# EAGLE design HeaterMeterLCD (EAGLE 6.6.0)
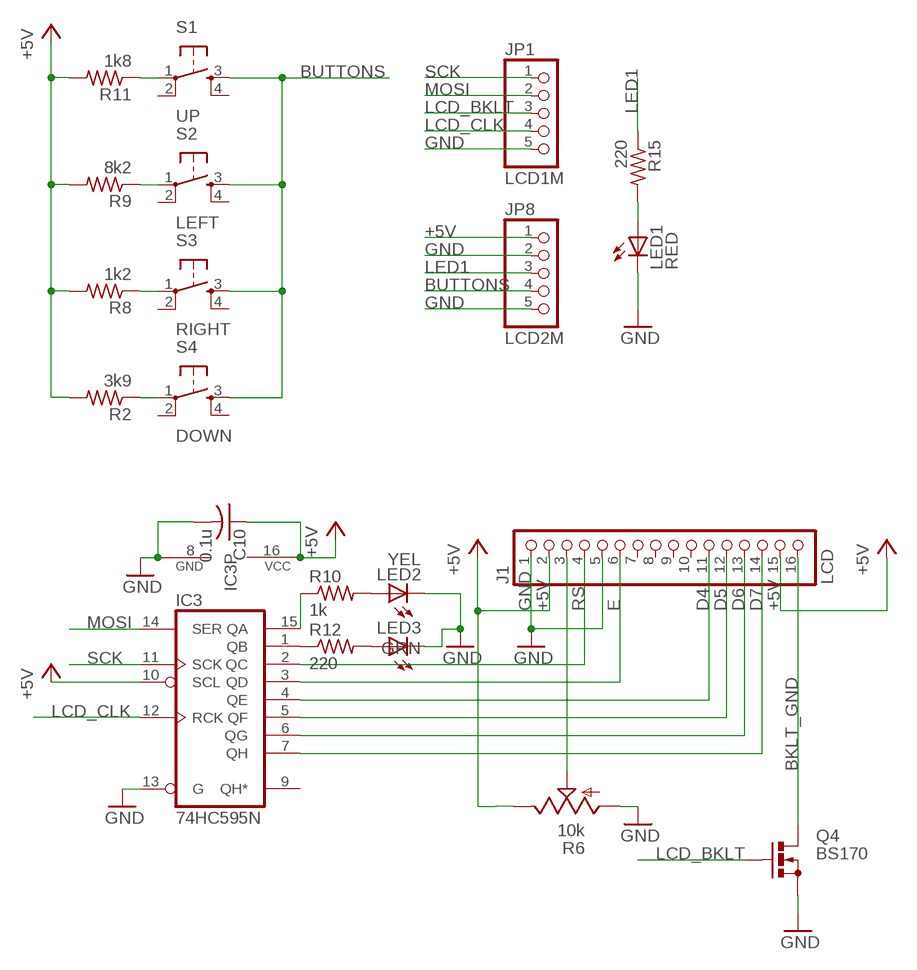
[diagram p0: schematic, sheet 1]

## Parts
C10  0.1u  C-US025-025X050  [C025-025X050]
IC3  74HC595N  74LS595N  [DIL16]
J1  LCD  PINHD-1X16  [1X16]
JP1  LCD1M  PINHD-1X5  [1X05]
JP8  LCD2M  PINHD-1X5  [1X05]
LED1  RED  LED3MM  [LED3MM]
LED2  YEL  LED3MM  [LED3MM]
LED3  GRN  LED3MM  [LED3MM]
Q4  BS170  [SOT54E]
R2  3k9  R-US_0204/7  [0204/7]
R6  10k  POTENTIOMETERSIDE  [POT-CT6-SIDE]
R8  1k2  R-US_0204/7  [0204/7]
R9  8k2  R-US_0204/7  [0204/7]
R10  1k  R-US_0204/7  [0204/7]
R11  1k8  R-US_0204/7  [0204/7]
R12  220  R-US_0204/7  [0204/7]
R15  220  R-US_0204/7  [0204/7]
S1  UP  TACTILE  [TACT-OMRON-12MM]
S2  LEFT  TACTILE  [TACT-OMRON-12MM]
S3  RIGHT  TACTILE  [TACT-OMRON-12MM]
S4  DOWN  TACTILE  [TACT-OMRON-12MM]

## Nets
+5V [POW]: C10.1 IC3.10(SCL) IC3.16(VCC) J1.2 J1.15 JP8.1 R2.2 R6.E R8.2 R9.2 R11.2
BKLT_GND [POW]: J1.16 Q4.D
BUTTONS: JP8.4 S1.3 S2.3 S3.3 S4.3
D4 [THIN]: IC3.4(QE) J1.11
D5 [THIN]: IC3.5(QF) J1.12
D6 [THIN]: IC3.6(QG) J1.13
D7 [THIN]: IC3.7(QH) J1.14
E: IC3.3(QD) J1.6
GND [GND]: C10.2 IC3.8(GND) IC3.13(G) J1.1 J1.5 JP1.5 JP8.2 JP8.5 LED1.K(C) LED2.K(C) LED3.K(C) Q4.S R6.A
LCD_BKLT: JP1.3 Q4.G
LCD_CLK: IC3.12(RCK) JP1.4
LED1: JP8.3 R15.1
MOSI: IC3.14(SER) JP1.2
N$1: R2.1 S4.1
N$2: R11.1 S1.1
N$3: J1.3 R6.S
N$4: R9.1 S2.1
N$5: LED2.A R10.2
N$6: LED1.A R15.2
N$7: R8.1 S3.1
N$18: IC3.15(QA) R10.1
N$19: IC3.1(QB) R12.1
N$20: LED3.A R12.2
RS: IC3.2(QC) J1.4
SCK: IC3.11(SCK) JP1.1
Unconnected: IC3.9(QH*) J1.7 J1.8 J1.9 J1.10 S1.2 S1.4 S2.2 S2.4 S3.2 S3.4 S4.2 S4.4

## Library data of the parts
C10 = resistor:C-US: CAPACITOR, American symbol
IC3 = 74xx-us:74*595: 8-bit SHIFT REGISTER, output latch
J1 = pinhead:PINHD-1X16: PIN HEADER
JP1 JP8 = pinhead:PINHD-1X5: PIN HEADER
LED1-LED3 = led:LED: LED OSRAM: - CHIPLED LG R971, LG N971, LY N971, LG Q971, LY Q971, LO R971, LY R971 LH N974, LH R974 LS Q976, LO Q976, LY Q976 LO Q996 - Hyper CHIPLED LW Q18S LB Q993, LB Q99A, LB R99A - SideLED LS A670, LO A670, LY A670, LG A670, LP A670 LB A673, LV A673, LT A673, LW A673 LH A674 LY A675 LS A676, LA A676, LO A676, LY A676, LW A676 LS A679, LY A679, LG A679 - Hyper Micro SIDELED® LS Y876, LA Y876, LO Y876, LY Y876 LT Y87S - SmartLED LW L88C, LW L88S LB L89C, LB L89S, LG L890 LS L89K, LO L89K, LY L89K LS L896, LA L896, LO L896, LY L896 - TOPLED LS T670, LO T670, LY T670, LG T670, LP T670 LSG T670, LSP T670, LSY T670, LOP T670, LYG T670 LG T671, LOG T671, LSG T671 LB T673, LV T673, LT T673, LW T673 LH T674 LS T676, LA T676, LO T676, LY T676, LB T676, LH T676, LSB T676, LW T676 LB T67C, LV T67C, LT T67C, LS T67K, LO T67K, LY T67K, LW E67C LS E67B, LA E67B, LO E67B, LY E67B, LB E67C, LV E67C, LT E67C LW T67C LS T679, LY T679, LG T679 LS T770, LO T770, LY T770, LG T770, LP T770 LB T773, LV T773, LT T773, LW T773 LH T774 LS E675, LA E675, LY E675, LS T675 LS T776, LA T776, LO T776, LY T776, LB T776 LHGB T686 LT T68C, LB T68C - Hyper Mini TOPLED® LB M676 - Mini TOPLED Santana® LG M470 LS M47K, LO M47K, LY M47K Source: http://www.osram.convergy.de LUXEON: - LUMILED® LXK2-PW12-R00, LXK2-PW12-S00, LXK2-PW14-U00, LXK2-PW14-V00 LXK2-PM12-R00, LXK2-PM12-S00, LXK2-PM14-U00 LXK2-PE12-Q00, LXK2-PE12-R00, LXK2-PE12-S00, LXK2-PE14-T00, LXK2-PE14-U00 LXK2-PB12-K00, LXK2-PB12-L00, LXK2-PB12-M00, LXK2-PB14-N00, LXK2-PB14-P00, LXK2-PB14-Q00 LXK2-PR12-L00, LXK2-PR12-M00, LXK2-PR14-Q00, LXK2-PR14-R00 LXK2-PD12-Q00, LXK2-PD12-R00, LXK2-PD12-S00 LXK2-PH12-R00, LXK2-PH12-S00 LXK2-PL12-P00, LXK2-PL12-Q00, LXK2-PL12-R00 Source: www.luxeon.com KINGBRIGHT: KA-3528ASYC Source: www.kingbright.com
Q4 = transistor-small-signal:BS170: N-CHANNEL MOS FET
R2 R8-R12 R15 = resistor:R-US_: RESISTOR, American symbol
R6 = Bryan:POTENTIOMETER
S1-S4 = Bryan:TACTILE

## Net classes
0 default: width 0.305 mm
1 POW: width 0.305 mm
2 THIN: width 0.254 mm
3 GND: width 0.508 mm

## Board
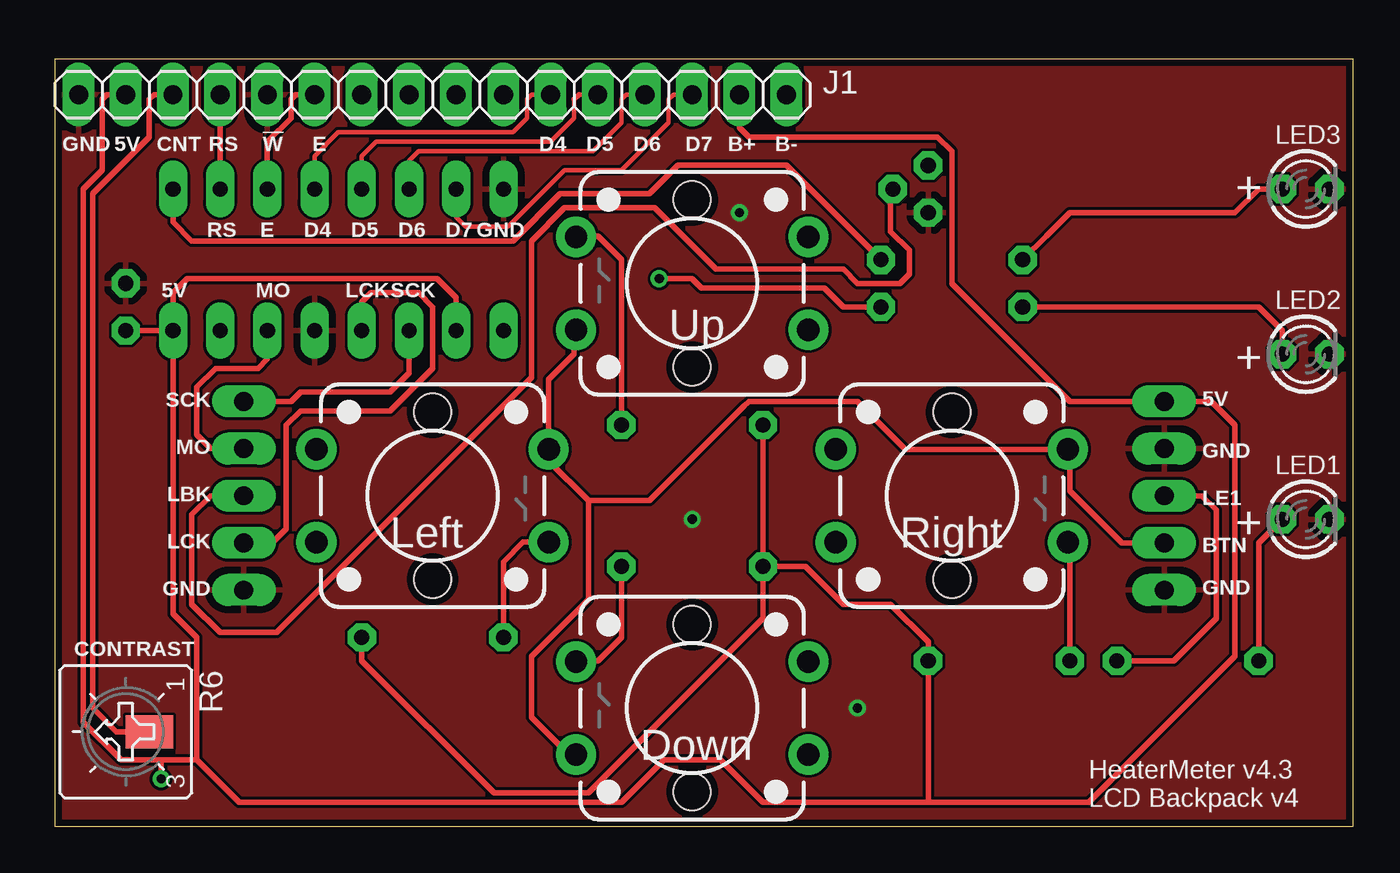
[diagram p1: board, top side]
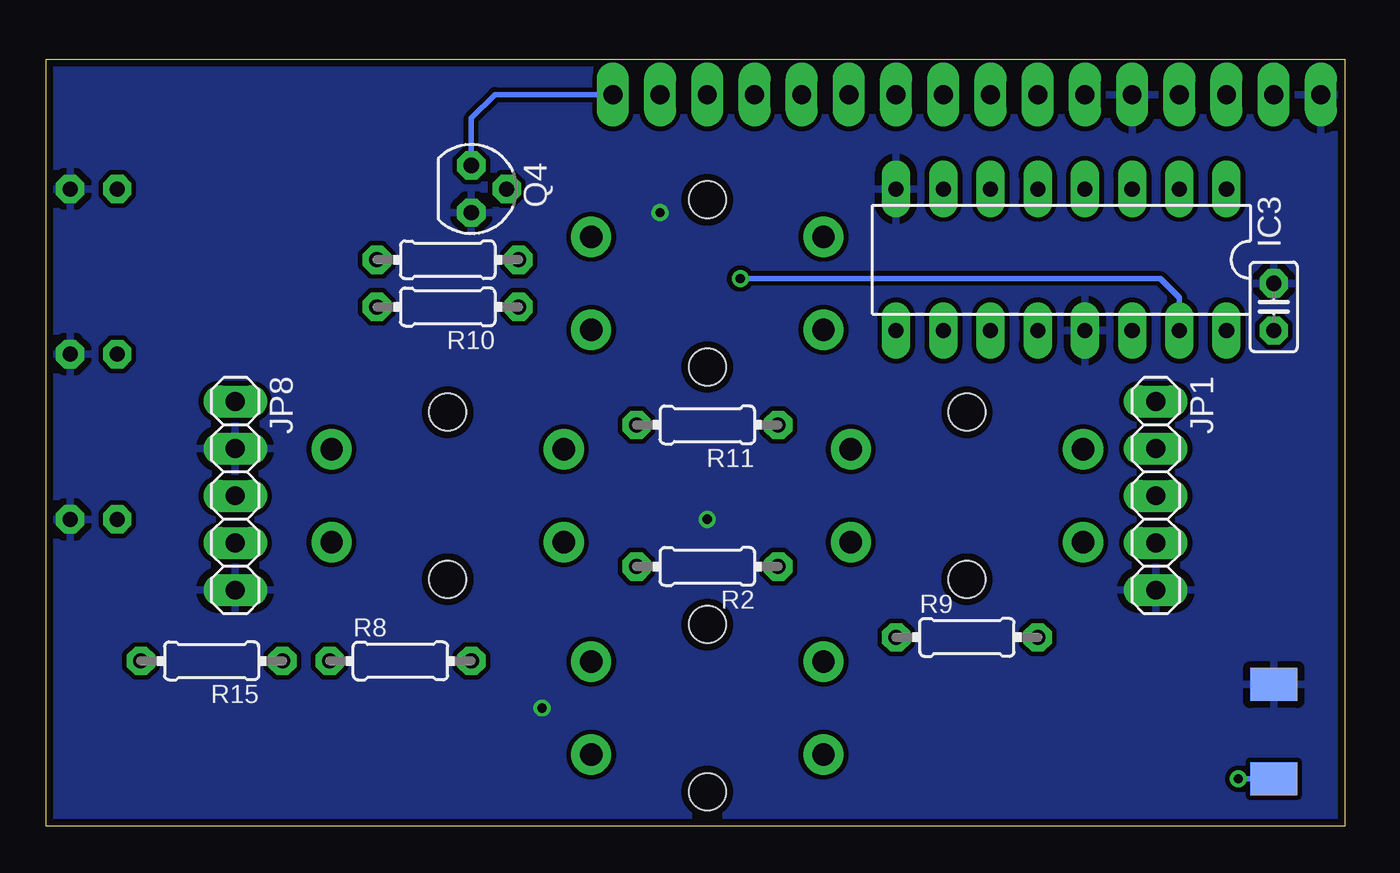
[diagram p2: board, bottom side, seen from below]

Size 69.85 x 41.27 mm. Coordinates in mm from the lower left corner, seen from the top.
Outline: 0,0 69.85,0 69.85,41.27 0,41.27 0,0
Copper layers (1*16): Top 0.035mm / dielectric 1.5mm / Bottom 0.035mm
Design rules "BryTest *": minimum track width 10mil, minimum drill 13mil, track to track 6mil, track to pad 6mil, pad to pad 6mil, via to via 6mil, smd to smd 6mil, copper to edge 15mil, drill to drill 20mil, minimum pad ring 14mil, minimum via ring 8mil, stop-mask expansion 4mil, vias tented up to drill 20mil, thermal gap 15mil

### Footprints (pad centres in the part's own frame; a part is rotated, then mirrored left to right if it is on the bottom)
C025-025X050 = drill 0.813 octagon: 1 -1.27,0; 2 1.27,0
DIL16 = drill 0.813 long: 1 -8.89,-3.81; 2 -6.35,-3.81; 3 -3.81,-3.81; 4 -1.27,-3.81; 5 1.27,-3.81; 6 3.81,-3.81; 7 6.35,-3.81; 8 8.89,-3.81; 9 8.89,3.81; 10 6.35,3.81; 11 3.81,3.81; 12 1.27,3.81; 13 -1.27,3.81; 14 -3.81,3.81; 15 -6.35,3.81; 16 -8.89,3.81
1X16 = drill 1.016 long: 1 -19.05,0; 2 -16.51,0; 3 -13.97,0; 4 -11.43,0; 5 -8.89,0; 6 -6.35,0; 7 -3.81,0; 8 -1.27,0; 9 1.27,0; 10 3.81,0; 11 6.35,0; 12 8.89,0; 13 11.43,0; 14 13.97,0; 15 16.51,0; 16 19.05,0
1X05 = drill 1.016 long: 1 -5.08,0; 2 -2.54,0; 3 0,0; 4 2.54,0; 5 5.08,0
LED3MM = drill 0.813 octagon: A -1.27,0; K 1.27,0
SOT54E = drill 0.813 octagon: D -1.27,0; G 0,1.905; S 1.27,0
0204/7 = drill 0.813 octagon: 1 -3.81,0; 2 3.81,0
POT-CT6-SIDE = smd 1.778 x 2.54 bottom: A 2.54,0; E -2.54,0 | smd 1.778 x 2.54: S 0,-1.27
TACT-OMRON-12MM = drill 1.2 pad 2.159: 1 6.25,-2.5; 2 -6.25,-2.5; 3 6.25,2.5; 4 -6.25,2.5 | hole 2: 0,4.5; 0,-4.5

### Placement (x,y rotation side)
C10  3.81,27.94 90 bottom
IC3  15.24,30.48 180 bottom
J1  20.32,39.37 0 top
JP1  10.16,17.78 270 bottom
JP8  59.69,17.78 270 bottom
LED1  67.31,16.51 0 top
LED2  67.31,25.4 0 top
LED3  67.31,34.29 0 top
Q4  46.99,34.29 270 bottom
R2  34.29,13.97 180 bottom
R6  3.81,5.08 90 top
R8  50.8,8.89 0 bottom
R9  20.32,10.16 0 bottom
R10  48.26,27.94 180 bottom
R11  34.29,21.59 180 bottom
R12  48.26,30.48 180 bottom
R15  60.96,8.89 180 bottom
S1  34.29,29.21 180 top
S2  20.32,17.78 0 top
S3  48.26,17.78 0 top
S4  34.29,6.35 180 top

### Tracks (layer width: path | path; a pad name or v marks a point on that pad's centre or on a via)
+5V  (via drill 0.5)
  Top 0.305: J1.2 2.79,39.37 2.54,39.12 2.54,35.31 1.52,34.29 1.52,5.59 3.56,3.56 5.71,3.56 | J1.15 36.83,37.59 37.34,37.08 39.62,37.08 47.5,37.08 48.26,36.32 48.26,35.05 48.26,30.73 48.26,29.21 54.61,22.86 56.13,22.86 JP8.1 62.23,22.86 63.5,21.59 63.5,21.08 63.5,9.14 55.63,1.27 53.34,1.27 46.99,1.27 | 46.99,1.27 38.1,1.27 35.81,3.56 32.77,3.56 30.48,1.27 9.91,1.27 7.62,3.56 | C10.1 IC3.16 | IC3.10 21.59,28.45 20.57,29.46 7.11,29.46 6.35,28.7 IC3.16 | IC3.16 6.35,25.4 6.35,24.13 6.35,11.43 7.62,10.16 7.62,3.56 | 46.99,9.91 R8.2 | R8.2 46.99,9.91 | 46.99,9.91 44.96,11.94 42.42,11.94 40.39,13.97 R2.2 | R9.2 16.51,8.89 23.62,1.78 28.7,1.78 38.1,11.18 R2.2 | R8.2 46.99,1.27 | 7.62,3.56 5.71,3.56 | v5.71,2.54 5.71,3.56 | R11.2 R2.2
  Bottom 0.305: R6.E v5.71,2.54
BKLT_GND
  Bottom 0.305: Q4.D 46.99,38.1 45.72,39.37 J1.16
BUTTONS
  Top 0.305: 28.7,17.53 26.57,19.66 S2.3 26.57,24.03 27.94,25.4 27.94,26.61 S1.3 | 28.7,17.53 28.7,12.19 25.65,9.14 25.65,5.84 27.69,3.81 28,3.81 S4.3 | 28.7,17.53 32,17.53 37.08,22.61 | 37.08,22.61 37.34,22.86 | JP8.4 57.4,15.24 54.61,18.03 54.61,20.18 S3.3 45.76,20.28 43.18,22.86 37.34,22.86 | 37.34,22.86 37.08,22.61
D4
  Top 0.254: J1.11 25.65,39.37 25.4,39.12 25.4,38.1 24.64,37.34 15.24,37.34 13.97,36.07 IC3.4
D5
  Top 0.254: J1.12 28.19,39.37 | 27.94,39.12 27.94,38.1 26.67,36.83 17.27,36.83 16.51,36.07 IC3.5
  Top 0.305: 28.19,39.37 27.94,39.12
D6
  Top 0.254: J1.13 30.73,39.37 30.48,39.12 30.48,37.85 28.96,36.32 19.56,36.32 19.05,35.81 IC3.6
D7
  Top 0.254: IC3.7 21.59,32.77 22.1,32.26 24.38,32.26 27.43,35.31 30.48,35.31 33.02,37.85 33.02,39.12 33.27,39.37 J1.14
E
  Top 0.305: J1.6 12.95,39.37 12.7,39.12 12.7,38.1 11.43,36.83 IC3.3
GND  (via drill 0.5)
  other vias: 34.29,16.51 43.18,6.35 36.83,33.02
  pour Bottom (isolate 0.254): 0,0 0,41.91 69.85,41.91 69.85,0
  pour Top: 0,0 0,41.91 69.85,41.91 69.85,0
LCD_BKLT
  Top 0.305: JP1.3 8.38,17.78 7.37,16.76 7.37,12.7 7.37,11.94 8.89,10.41 11.94,10.41 25.65,24.13 25.65,31.5 27.43,33.27 32.26,33.27 35.56,29.97 42.42,29.97 43.18,29.21 45.47,29.21 45.97,29.72 45.97,30.99 44.96,32 44.96,34.16 Q4.G
LCD_CLK
  Top 0.305: IC3.12 16.51,28.19 17.02,28.7 19.56,28.7 20.32,27.94 20.32,24.64 18.03,22.35 13.21,22.35 12.45,21.59 12.45,16 11.68,15.24 JP1.4
LED1
  Top 0.305: JP8.3 61.72,17.78 62.48,17.02 62.48,11.18 60.2,8.89 R15.1
MOSI
  Top 0.305: IC3.14 11.43,25.15 10.92,24.64 8.64,24.64 7.62,23.62 7.62,21.08 8.38,20.32 JP1.2
N$1
  Top 0.305: R2.1 30.48,10.16 29.21,8.89 28.08,8.89 S4.1
N$2
  Top 0.305: R11.1 30.48,30.48 29.21,31.75 28.08,31.75 S1.1
N$3
  Top 0.305: J1.3 5.33,39.37 5.08,39.12 5.08,37.08 2.03,34.04 2.03,8.64 2.03,6.35 3.3,5.08 R6.S
N$4
  Top 0.305: S2.1 25.19,15.28 24.13,14.22 R9.1
N$5
  Top 0.305: R10.2 64.77,27.94 66.04,26.67 LED2.A
N$6
  Top 0.305: R15.2 64.77,15.24 LED1.A
N$7
  Top 0.305: R8.1 54.61,15.18 S3.1
N$18  (via drill 0.5)
  Top 0.305: v32.51,29.46 34.29,29.46 34.8,28.96 41.4,28.96 42.42,27.94 R10.1
  Bottom 0.305: IC3.15 8.89,28.45 9.91,29.46 v32.51,29.46
N$19
  Top 0.305: IC3.1 6.35,32.51 7.37,31.5 24.64,31.5 27.18,34.04 32,34.04 33.53,35.56 39.37,35.56 43.18,31.75 R12.1
N$20
  Top 0.305: LED3.A 64.77,34.29 63.5,33.02 54.61,33.02 53.34,31.75 R12.2
RS
  Top 0.305: J1.4 IC3.2
SCK
  Top 0.305: IC3.11 19.05,24.38 18.03,23.37 13.21,23.37 12.7,22.86 JP1.1

### Text on the board
_tsilk: GND | 5V | CNT | RS | !W | E | D4 | D5 | D6 | D7 | B+ | B- | + | RS | E | D4 | D5 | D6 | D7 | GND | 5V | MO | LCK | SCK | Up | + | SCK | 5V | MO | GND | LBK | LE1 | LCK | + | Left | Right | BTN | GND | GND | CONTRAST | Down | HeaterMeter v4.3 | LCD Backpack v4